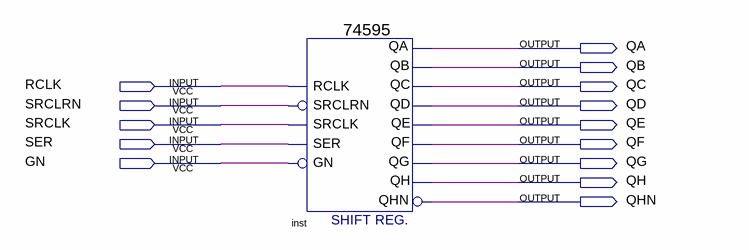
[diagram p0: schematic sheet]
// Quartus schematic testshift.bdf as structural Verilog: 1 symbols, 14 pins
module testshift (
  input  RCLK,
  input  SRCLRN,
  input  SRCLK,
  input  SER,
  input  GN,
  output QA,
  output QB,
  output QC,
  output QD,
  output QE,
  output QF,
  output QG,
  output QH,
  output QHN
);

  \74595  inst (
    .RCLK(RCLK), .SRCLRN(SRCLRN), .SRCLK(SRCLK), .SER(SER), .GN(GN), .QHN(QHN), .QH(QH), .QG(QG), .QF(QF),
    .QE(QE), .QC(QC), .QD(QD), .QA(QA), .QB(QB));
endmodule
